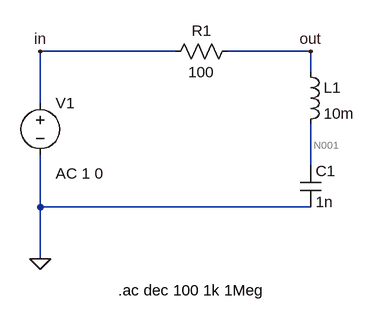
[diagram p0: schematic rlc-resonant-filter.asc]
rlc-resonant-filter.asc, the LTspice schematic file:
Version 4.1
SHEET 1 880 680
WIRE 128 -96 -80 -96
WIRE 336 -96 208 -96
WIRE 336 -64 336 -96
WIRE -80 -16 -80 -96
WIRE 336 80 336 16
WIRE -80 144 -80 64
WIRE 336 144 -80 144
WIRE -80 224 -80 144
FLAG -80 224 0
FLAG -80 -96 in
FLAG 336 -96 out
SYMBOL voltage -80 -32 R0
WINDOW 123 24 124 Left 2
WINDOW 39 0 0 Left 0
SYMATTR Value2 AC 1 0
SYMATTR InstName V1
SYMATTR Value ""
SYMBOL res 224 -112 R90
WINDOW 0 0 56 VBottom 2
WINDOW 3 32 56 VTop 2
SYMATTR InstName R1
SYMATTR Value 100
SYMBOL cap 320 80 R0
SYMATTR InstName C1
SYMATTR Value 1n
SYMBOL ind 320 -80 R0
SYMATTR InstName L1
SYMATTR Value 10m
TEXT 40 272 Left 2 !.ac dec 100 1k 1Meg

The netlist it stands for:
* rlc-resonant-filter.asc
V1 in 0 AC 1 0
R1 out in 100
C1 N001 0 1n
L1 out N001 10m
.ac dec 100 1k 1Meg
.backanno
.end

* Results of the author's LTspice run, read from the files saved beside the schematic
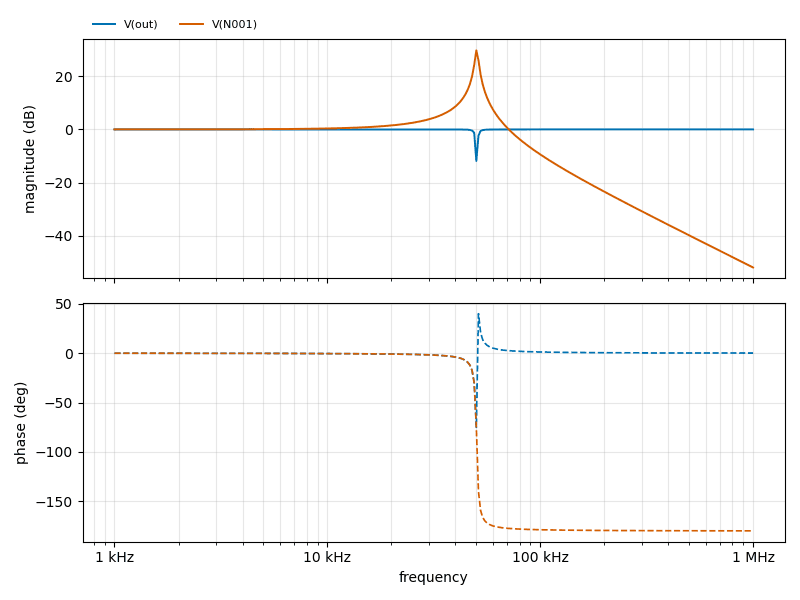
[diagram p1: AC Analysis of rlc-resonant-filter.asc, plotted from the saved traces]
* AC Analysis, 1 run:
*   V(out): -0.00 dB at 1 kHz, -0.00 dB at 1 MHz, peak -0.00 dB at 1 kHz, 3 dB below the peak at 49.16 kHz
*   V(N001): 0.00 dB at 1 kHz, -51.91 dB at 1 MHz, peak 29.74 dB at 50.12 kHz, 3 dB below the peak at 49.49 kHz and 51.06 kHz